# Altium schematic sheet con-right-bot.SchDoc: Right Bottom Connector
size Letter; CheckedBy: J. Brinton; CompanyName: Signal Laboratories, Inc.; DrawnBy: J. Brinton; Engineer: J. Brinton; Address1: 3479 Edison Way; Address2: Menlo Park CA 94025; Address3: +1 (877) 778-8435; Address4: siglabs.com; Revision: 3; SheetNumber: 47; SheetTotal: 49; ModifiedDate: 4/20/2018
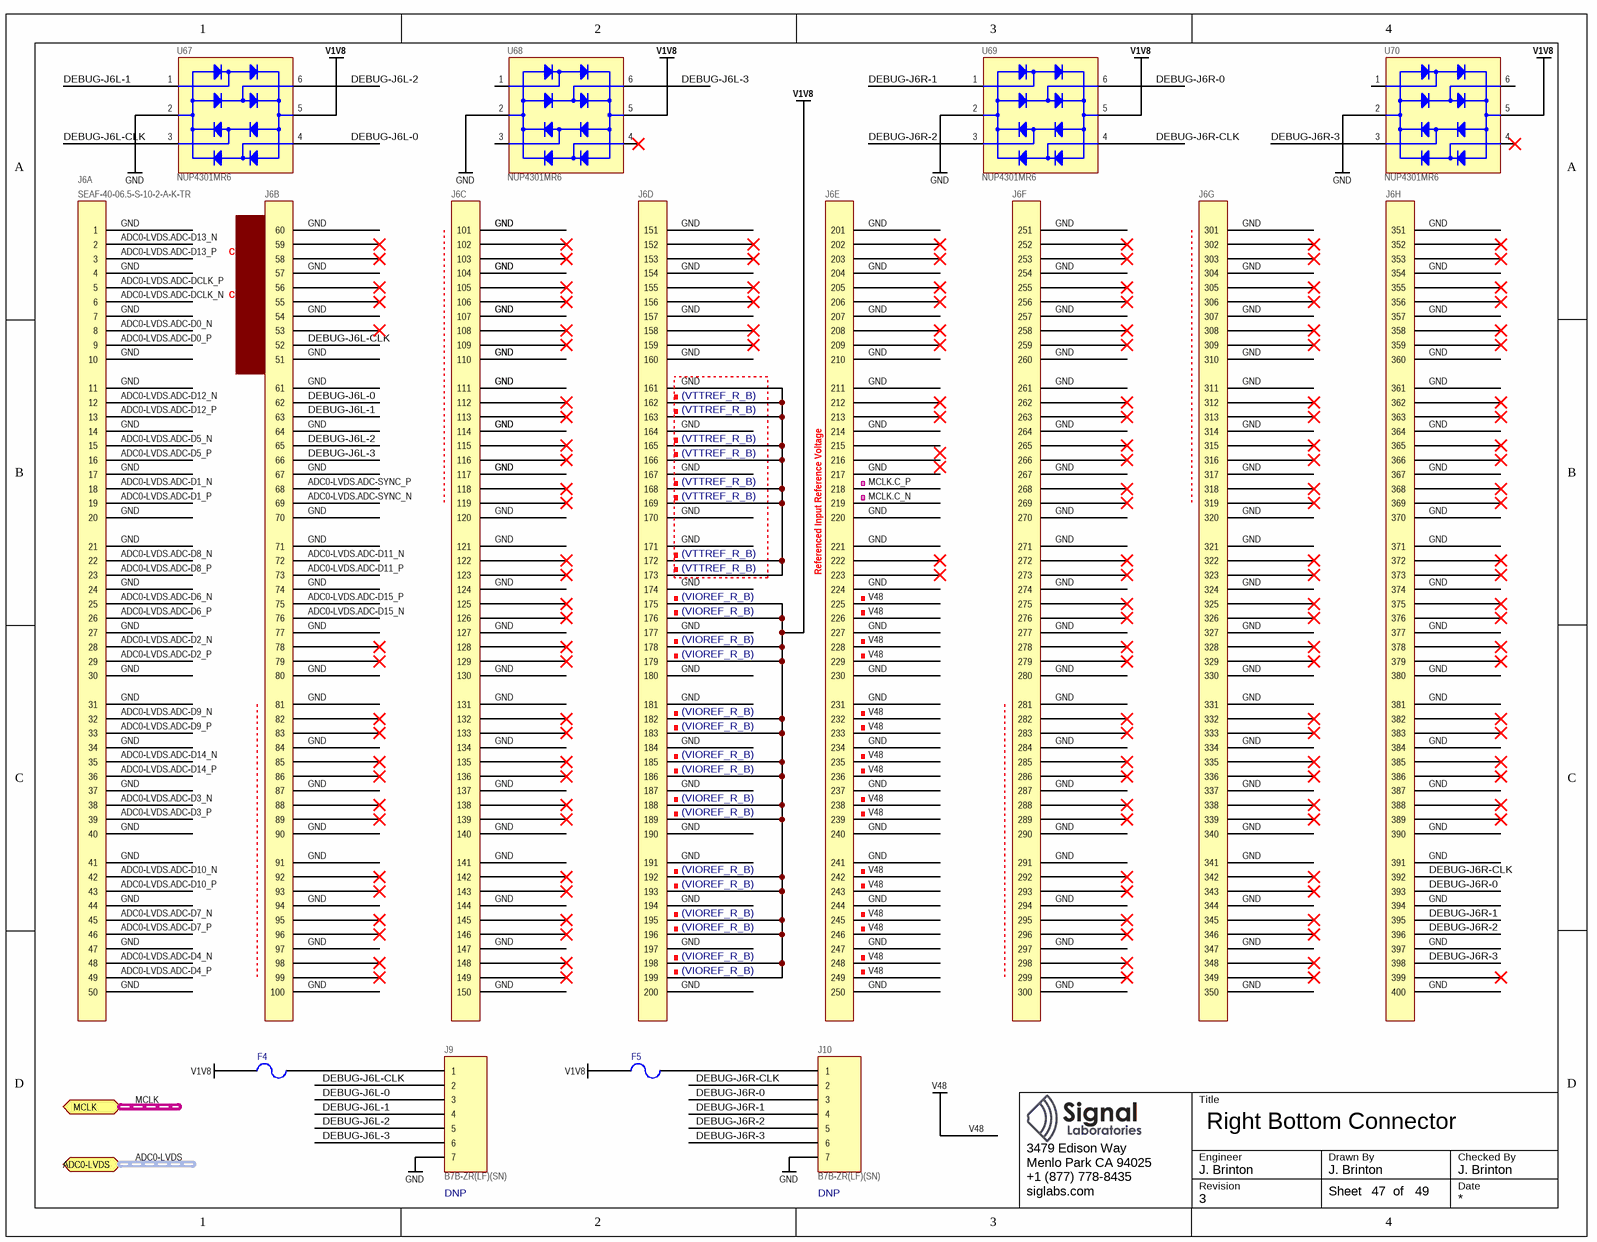
[diagram p0: con-right-bot.SchDoc]

## Parts
F4  0ZCJ0020FF2E  [1206]  (value not drawn)
F5  0ZCJ0020FF2E  [1206]  (value not drawn)
J6  SEAF-40-06.5-S-10-2-A-K-TR  [SEAF-40-06.5-S-10-2-A-K-TR]  (parts A,B,C,D,E,F,G,H of 8)
J9  B7B-ZR(LF)(SN)  Do Not Place: DNP  [B7B-ZR]
J10  B7B-ZR(LF)(SN)  Do Not Place: DNP  [B7B-ZR]
U67  NUP4301MR6  [SOT23-6]
U68  NUP4301MR6  [SOT23-6]
U69  NUP4301MR6  [SOT23-6]
U70  NUP4301MR6  [SOT23-6]

## Ports
ADC0-LVDS (harness ADC-LVDS), MCLK (harness CLK-LVPECL33)

## Nets
GND: J6.1 J6.4 J6.7 J6.10 J6.11 J6.14 J6.17 J6.20 J6.21 J6.24 J6.27 J6.30 J6.31 J6.34 J6.37 J6.40 J6.41 J6.44 J6.47 J6.50 J6.51 J6.54 J6.57 J6.60 J6.61 J6.64 J6.67 J6.70 J6.71 J6.74 J6.77 J6.80 J6.81 J6.84 J6.87 J6.90 J6.91 J6.94 J6.97 J6.100 J6.101 J6.104 J6.107 J6.110 J6.111 J6.114 J6.117 J6.120 J6.121 J6.124 J6.127 J6.130 J6.131 J6.134 J6.137 J6.140 J6.141 J6.144 J6.147 J6.150 J6.151 J6.154 J6.157 J6.160 J6.161 J6.162 J6.163 J6.164 J6.165 J6.166 J6.167 J6.168 J6.169 J6.170 J6.171 J6.172 J6.173 J6.174 J6.177 J6.180 J6.181 J6.184 J6.187 J6.190 J6.191 J6.194 J6.197 J6.200 J6.201 J6.204 J6.207 J6.210 J6.211 J6.214 J6.217 J6.220 J6.221 J6.224 J6.227 J6.230 J6.231 J6.234 J6.237 J6.240 J6.241 J6.244 J6.247 J6.250 J6.251 J6.254 J6.257 J6.260 J6.261 J6.264 J6.267 J6.270 J6.271 J6.274 J6.277 J6.280 J6.281 J6.284 J6.287 J6.290 J6.291 J6.294 J6.297 J6.300 J6.301 J6.304 J6.307 J6.310 J6.311 J6.314 J6.317 J6.320 J6.321 J6.324 J6.327 J6.330 J6.331 J6.334 J6.337 J6.340 J6.341 J6.344 J6.347 J6.350 J6.351 J6.354 J6.357 J6.360 J6.361 J6.364 J6.367 J6.370 J6.371 J6.374 J6.377 J6.380 J6.381 J6.384 J6.387 J6.390 J6.391 J6.394 J6.397 J6.400 J9.7 J10.7 U67.2(VN) U68.2(VN) U69.2(VN) U70.2(VN)
V1V8: F4.2 F5.2 J6.175 J6.176 J6.178 J6.179 J6.182 J6.183 J6.185 J6.186 J6.188 J6.189 J6.192 J6.193 J6.195 J6.196 J6.198 J6.199 U67.5(VP) U68.5(VP) U69.5(VP) U70.5(VP)
V48: J6.225 J6.226 J6.228 J6.229 J6.232 J6.233 J6.235 J6.236 J6.238 J6.239 J6.242 J6.243 J6.245 J6.246 J6.248 J6.249
ADC0-LVDS.ADC-D0_N: J6.8
ADC0-LVDS.ADC-D0_P: J6.9
ADC0-LVDS.ADC-D1_N: J6.18
ADC0-LVDS.ADC-D1_P: J6.19
ADC0-LVDS.ADC-D2_N: J6.28
ADC0-LVDS.ADC-D2_P: J6.29
ADC0-LVDS.ADC-D3_N: J6.38
ADC0-LVDS.ADC-D3_P: J6.39
ADC0-LVDS.ADC-D4_N: J6.48
ADC0-LVDS.ADC-D4_P: J6.49
ADC0-LVDS.ADC-D5_N: J6.15
ADC0-LVDS.ADC-D5_P: J6.16
ADC0-LVDS.ADC-D6_N: J6.25
ADC0-LVDS.ADC-D6_P: J6.26
ADC0-LVDS.ADC-D7_N: J6.45
ADC0-LVDS.ADC-D7_P: J6.46
ADC0-LVDS.ADC-D8_N: J6.22
ADC0-LVDS.ADC-D8_P: J6.23
ADC0-LVDS.ADC-D9_N: J6.32
ADC0-LVDS.ADC-D9_P: J6.33
ADC0-LVDS.ADC-D10_N: J6.42
ADC0-LVDS.ADC-D10_P: J6.43
ADC0-LVDS.ADC-D11_N: J6.72
ADC0-LVDS.ADC-D11_P: J6.73
ADC0-LVDS.ADC-D12_N: J6.12
ADC0-LVDS.ADC-D12_P: J6.13
ADC0-LVDS.ADC-D13_N: J6.2
ADC0-LVDS.ADC-D13_P: J6.3
ADC0-LVDS.ADC-D14_N: J6.35
ADC0-LVDS.ADC-D14_P: J6.36
ADC0-LVDS.ADC-D15_N: J6.76
ADC0-LVDS.ADC-D15_P: J6.75
ADC0-LVDS.ADC-DCLK_N: J6.6
ADC0-LVDS.ADC-DCLK_P: J6.5
ADC0-LVDS.ADC-SYNC_N: J6.69
ADC0-LVDS.ADC-SYNC_P: J6.68
DEBUG-J6L-0: J6.62 J9.3 U67.4(C)
DEBUG-J6L-1: J6.63 J9.4 U67.1(A)
DEBUG-J6L-2: J6.65 J9.5 U67.6(D)
DEBUG-J6L-3: J6.66 J9.6 U68.6(D)
DEBUG-J6L-CLK: J6.52 J9.2 U67.3(B)
DEBUG-J6R-0: J6.393 J10.3 U69.6(D)
DEBUG-J6R-1: J6.395 J10.4 U69.1(A)
DEBUG-J6R-2: J6.396 J10.5 U69.3(B)
DEBUG-J6R-3: J6.398 J10.6 U70.3(B)
DEBUG-J6R-CLK: J6.392 J10.2 U69.4(C)
MCLK.C_N: J6.219
MCLK.C_P: J6.218
NetF4_1: F4.1 J9.1
NetF5_1: F5.1 J10.1

Not connected (* = marked no-connect by the designer): J6 53* 55* 56* 58* 59* 78* 79* 82* 83* 85* 86* 88* 89* 92* 93* 95* 96* 98* 99* 102* 103* 105* 106* 108* 109* 112* 113* 115* 116* 118* 119* 122* 123* 125* 126* 128* 129* 132* 133* 135* 136* 138* 139* 142* 143* 145* 146* 148* 149* 152* 153* 155* 156* 158* 159* 202* 203* 205* 206* 208* 209* 212* 213* 215 216 222* 223* 252* 253* 255* 256* 258* 259* 262* 263* 265* 266* 268* 269* 272* 273* 275* 276* 278* 279* 282* 283* 285* 286* 288* 289* 292* 293* 295* 296* 298* 299* 302* 303* 305* 306* 308* 309* 312* 313* 315* 316* 318* 319* 322* 323* 325* 326* 328* 329* 332* 333* 335* 336* 338* 339* 342* 343* 345* 346* 348* 349* 352* 353* 355* 356* 358* 359* 362* 363* 365* 366* 368* 369* 372* 373* 375* 376* 378* 379* 382* 383* 385* 386* 388* 389* 399*; U68 1(A) 3(B) 4(C)*; U70 1(A) 4(C)* 6(D)

## Buses and harness runs
harness ADC0-LVDS = port ADC0-LVDS
harness MCLK = port MCLK

## Notes on the sheet
- (near J6) CLK_IN
- (near J6) (VTTREF_R_B)
- (near J6) (VIOREF_R_B)
- (near J6) Referenced Input Reference Voltage
- Title
- Engineer
- Revision
- Drawn By
- Checked By
- Date
- Sheet
- of

## Library data of the parts
F4 F5 = 0ZCJ0020FF2E: PTC Resettable Fuse, 0.2A, 30V, SMD 1206; Manufacturer: Bell Fuse; Manufacturer P/N: 0ZCJ0020FF2E; Package: 1206
J6 = SEAF-40-06.5-S-10-2-A-K-TR: Terminal Array Assembly, Surface Mount, 0.050" Pitch, 400 Pins; Manufacturer: Samtec; Manufacturer P/N: SEAF-40-06.5-S-10-2-A-K-TR
J9 J10 = B7B-ZR(LF)(SN): Through-hole Shrouded Header 7-Position; Manufacturer: JST; Manufacturer P/N: B7B-ZR(LF)(SN)
U67-U70 = NUP4301MR6: 4-Lane TVS Diode Array; Manufacturer: On Semiconductor; Manufacturer P/N: NUP4301MR6